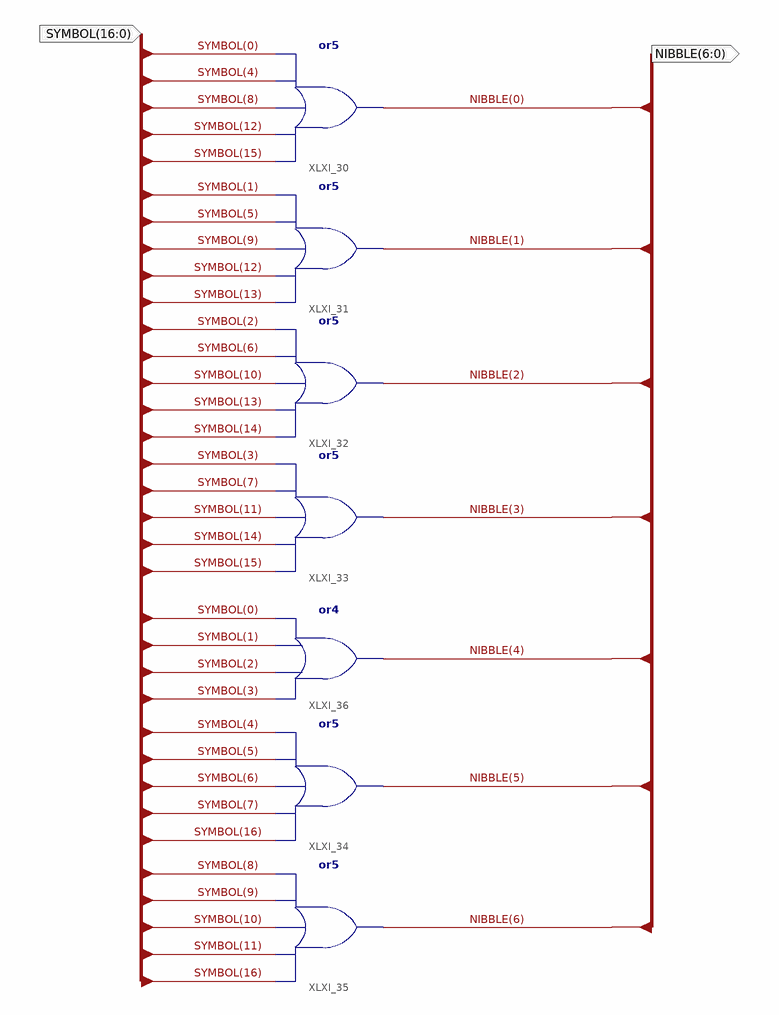
[diagram p0: schematic sheet 1]
// Xilinx ISE schematic Symbol_encoder.sch (xbr) as structural Verilog: 7 symbols, 2 ports
module Symbol_encoder (
  input  [16:0] SYMBOL,
  output [6:0] NIBBLE
);

  or XLXI_30 (NIBBLE[0], SYMBOL[15], SYMBOL[12], SYMBOL[8], SYMBOL[4], SYMBOL[0]);
  or XLXI_31 (NIBBLE[1], SYMBOL[13], SYMBOL[12], SYMBOL[9], SYMBOL[5], SYMBOL[1]);
  or XLXI_32 (NIBBLE[2], SYMBOL[14], SYMBOL[13], SYMBOL[10], SYMBOL[6], SYMBOL[2]);
  or XLXI_33 (NIBBLE[3], SYMBOL[15], SYMBOL[14], SYMBOL[11], SYMBOL[7], SYMBOL[3]);
  or XLXI_36 (NIBBLE[4], SYMBOL[3], SYMBOL[2], SYMBOL[1], SYMBOL[0]);
  or XLXI_34 (NIBBLE[5], SYMBOL[16], SYMBOL[7], SYMBOL[6], SYMBOL[5], SYMBOL[4]);
  or XLXI_35 (NIBBLE[6], SYMBOL[16], SYMBOL[11], SYMBOL[10], SYMBOL[9], SYMBOL[8]);
endmodule
